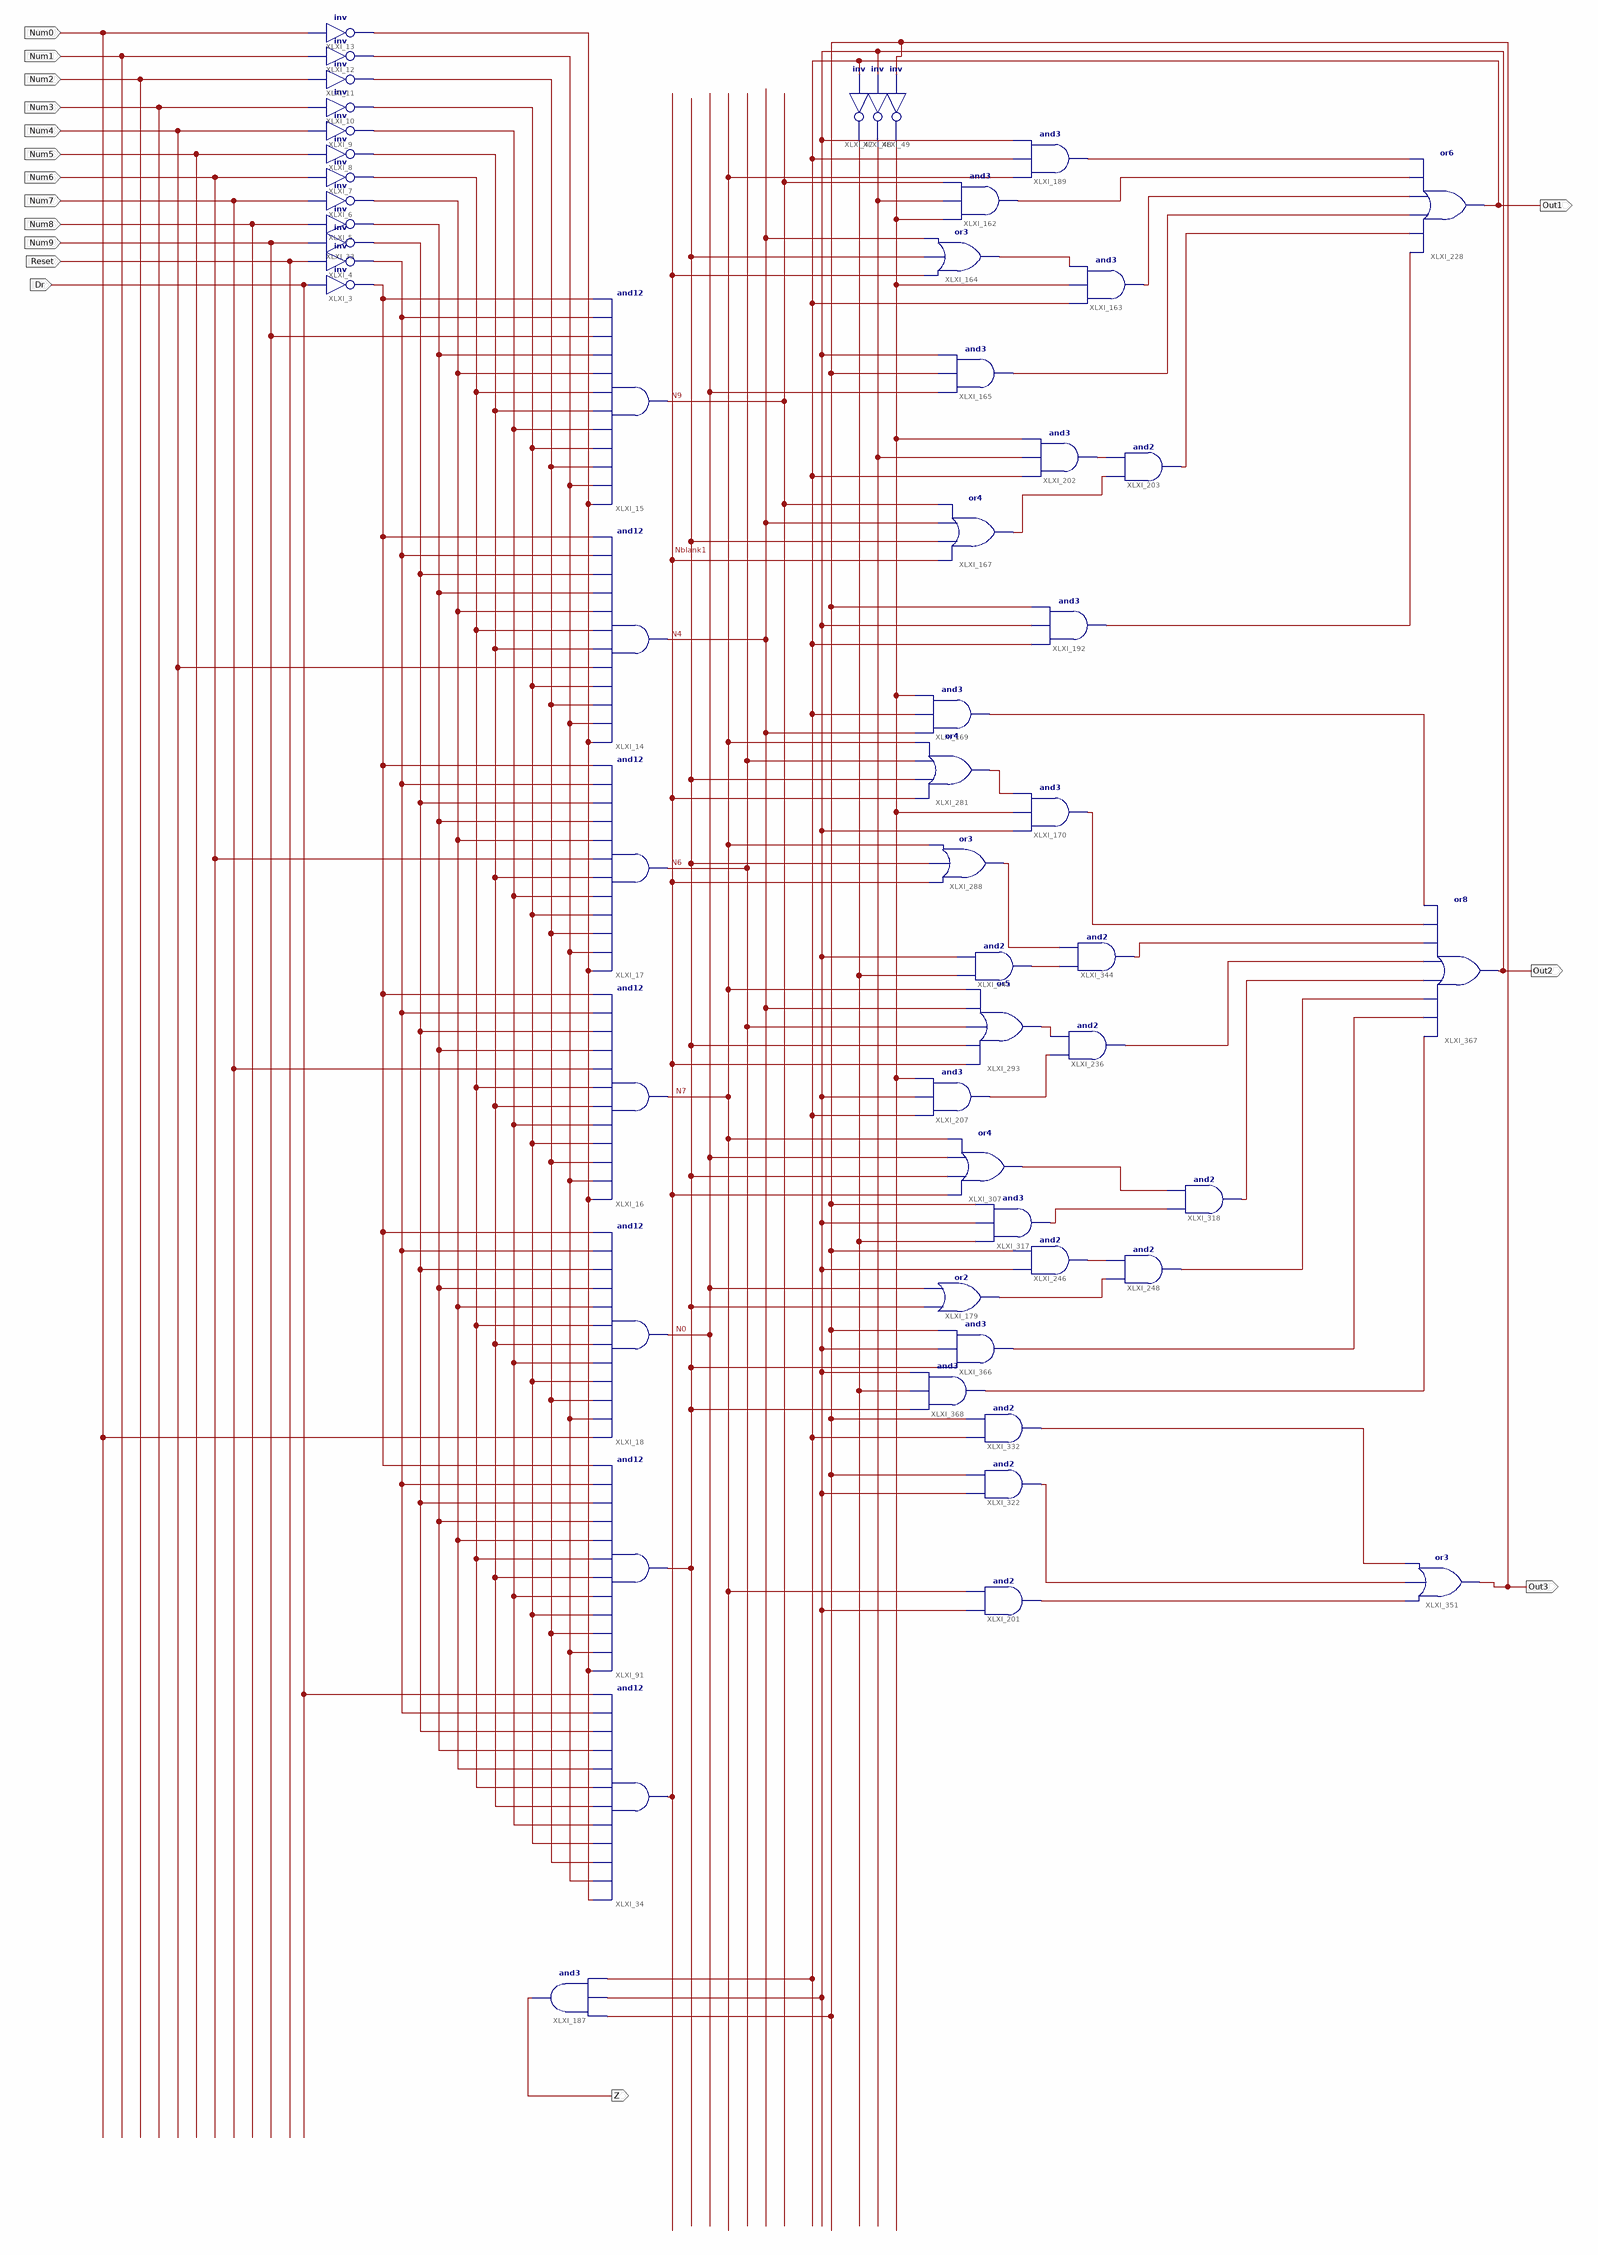
[diagram p0: schematic sheet 1]
// Xilinx ISE schematic GOGOGO.sch (spartan6) as structural Verilog: 55 symbols, 16 ports
module GOGOGO (
  input  Dr,
  input  Reset,
  input  Num8,
  input  Num7,
  input  Num6,
  input  Num5,
  input  Num4,
  input  Num3,
  input  Num1,
  input  Num0,
  input  Num2,
  input  Num9,
  output Out2,
  output Out1,
  output Out3,
  output Z
);

  wire N0, N4, N6, N7, N9, Nblank1, Ndr, XLXN_121, XLXN_410, XLXN_520, XLXN_521, XLXN_522, XLXN_523,
       XLXN_524, XLXN_525, XLXN_526, XLXN_527, XLXN_528, XLXN_529, XLXN_530, XLXN_688, XLXN_731, XLXN_732,
       XLXN_733, XLXN_734, XLXN_735, XLXN_736, XLXN_749, XLXN_760, XLXN_775, XLXN_796, XLXN_861, XLXN_866,
       XLXN_899, XLXN_916, XLXN_938, XLXN_940, XLXN_941, XLXN_1023, XLXN_1059, XLXN_1094, XLXN_1104,
       XLXN_1106, XLXN_1159, XLXN_1177, XLXN_1204, XLXN_1205, XLXN_1222, XLXN_1232, XLXN_1239, XLXN_1253;

  and XLXI_14 (N4, XLXN_521, XLXN_520, XLXN_121, XLXN_522, Num4, XLXN_524, XLXN_525, XLXN_526, XLXN_527, XLXN_528, XLXN_529, XLXN_530);
  and XLXI_15 (N9, XLXN_521, XLXN_520, XLXN_121, XLXN_522, XLXN_523, XLXN_524, XLXN_525, XLXN_526, XLXN_527, Num9, XLXN_529, XLXN_530);
  and XLXI_16 (N7, XLXN_521, XLXN_520, XLXN_121, XLXN_522, XLXN_523, XLXN_524, XLXN_525, Num7, XLXN_527, XLXN_528, XLXN_529, XLXN_530);
  and XLXI_17 (N6, XLXN_521, XLXN_520, XLXN_121, XLXN_522, XLXN_523, XLXN_524, Num6, XLXN_526, XLXN_527, XLXN_528, XLXN_529, XLXN_530);
  not XLXI_13 (XLXN_521, Num0);
  not XLXI_12 (XLXN_520, Num1);
  not XLXI_11 (XLXN_121, Num2);
  not XLXI_10 (XLXN_522, Num3);
  not XLXI_9 (XLXN_523, Num4);
  not XLXI_8 (XLXN_524, Num5);
  not XLXI_7 (XLXN_525, Num6);
  not XLXI_6 (XLXN_526, Num7);
  not XLXI_4 (XLXN_529, Reset);
  not XLXI_3 (XLXN_530, Dr);
  not XLXI_5 (XLXN_527, Num8);
  not XLXI_33 (XLXN_528, Num9);
  and XLXI_34 (Ndr, XLXN_521, XLXN_520, XLXN_121, XLXN_522, XLXN_523, XLXN_524, XLXN_525, XLXN_526, XLXN_527, XLXN_528, XLXN_529, Dr);
  not XLXI_47 (XLXN_1104, Out1);
  not XLXI_48 (XLXN_688, Out2);
  not XLXI_49 (XLXN_410, Out3);
  and XLXI_18 (N0, Num0, XLXN_520, XLXN_121, XLXN_522, XLXN_523, XLXN_524, XLXN_525, XLXN_526, XLXN_527, XLXN_528, XLXN_529, XLXN_530);
  and XLXI_91 (Nblank1, XLXN_521, XLXN_520, XLXN_121, XLXN_522, XLXN_523, XLXN_524, XLXN_525, XLXN_526, XLXN_527, XLXN_528, XLXN_529, XLXN_530);
  and XLXI_162 (XLXN_733, XLXN_410, XLXN_688, N9);
  and XLXI_163 (XLXN_734, Out1, XLXN_410, XLXN_731);
  or XLXI_164 (XLXN_731, Ndr, Nblank1, N4);
  and XLXI_165 (XLXN_735, N0, Out3, Out2);
  and XLXI_187 (Z, Out3, Out2, Out1);
  and XLXI_189 (XLXN_775, N7, Out1, Out2);
  or XLXI_167 (XLXN_732, Ndr, Nblank1, N4, N9);
  and XLXI_192 (XLXN_866, Out1, Out2, Out3);
  and XLXI_201 (XLXN_1205, Out2, N7);
  and XLXI_202 (XLXN_796, Out1, XLXN_688, XLXN_410);
  and XLXI_203 (XLXN_736, XLXN_732, XLXN_796);
  or XLXI_228 (Out1, XLXN_866, XLXN_736, XLXN_735, XLXN_734, XLXN_733, XLXN_775);
  and XLXI_246 (XLXN_940, Out2, Out3);
  and XLXI_248 (XLXN_938, XLXN_941, XLXN_940);
  or XLXI_179 (XLXN_941, Nblank1, N0);
  or XLXI_281 (XLXN_749, Ndr, Nblank1, N6, N7);
  and XLXI_170 (XLXN_1023, Out2, XLXN_410, XLXN_749);
  and XLXI_169 (XLXN_760, N4, Out1, XLXN_410);
  or XLXI_288 (XLXN_1222, Ndr, Nblank1, N7);
  and XLXI_236 (XLXN_1177, XLXN_899, XLXN_916);
  and XLXI_207 (XLXN_899, Out1, Out2, XLXN_410);
  or XLXI_293 (XLXN_916, Ndr, Nblank1, N6, N4, N7);
  or XLXI_307 (XLXN_1094, Ndr, Nblank1, N0, N7);
  and XLXI_317 (XLXN_1106, XLXN_1104, Out2, Out3);
  and XLXI_318 (XLXN_1159, XLXN_1106, XLXN_1094);
  and XLXI_332 (XLXN_861, Out1, Out3);
  and XLXI_343 (XLXN_1232, XLXN_1104, Out2);
  and XLXI_344 (XLXN_1059, XLXN_1232, XLXN_1222);
  and XLXI_322 (XLXN_1204, Out2, Out3);
  or XLXI_351 (Out3, XLXN_1205, XLXN_1204, XLXN_861);
  and XLXI_366 (XLXN_1239, Nblank1, Out2, Out3);
  or XLXI_367 (Out2, XLXN_1253, XLXN_1239, XLXN_938, XLXN_1159, XLXN_1177, XLXN_1059, XLXN_1023, XLXN_760);
  and XLXI_368 (XLXN_1253, Nblank1, XLXN_1104, Out2);
endmodule
